# Altium schematic sheet VRM.SchDoc
size A4
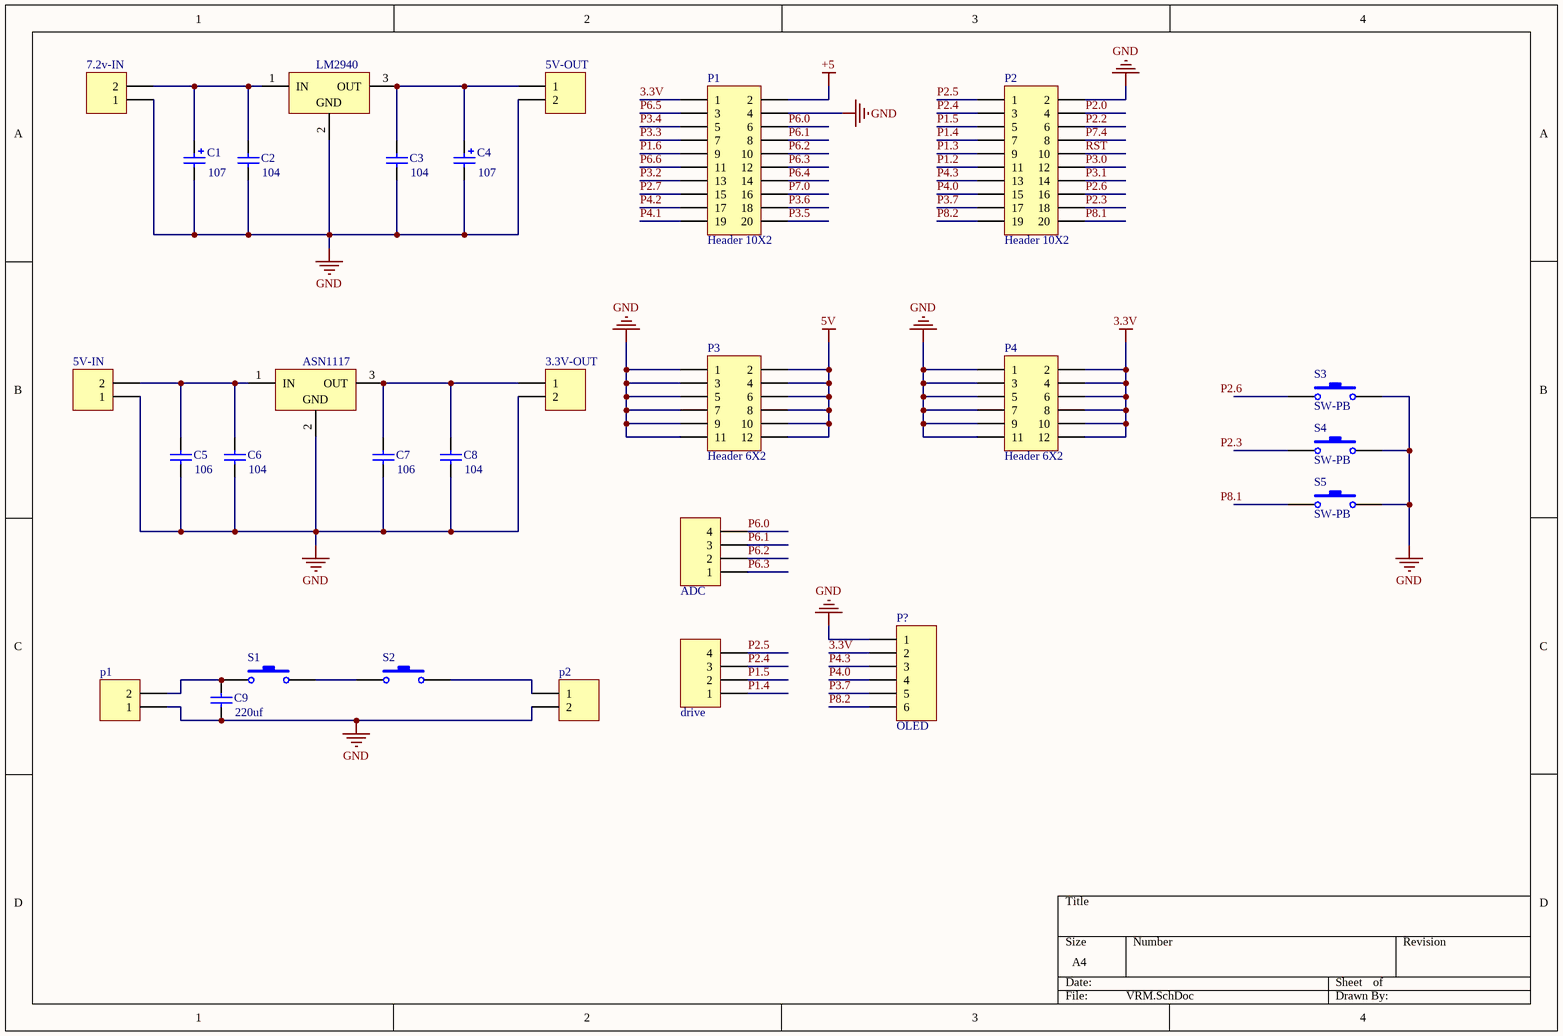
[diagram p0: VRM.SchDoc]

## Parts
(Parts that share a designator on the sheet are numbered #1, #2 ... from top to bottom, then left to right.)
3.3V-OUT  (no value)  [HDR1X2]
5V-IN  (no value)  [HDR1X2]
5V-OUT  (no value)  [HDR1X2]
7.2v-IN  (no value)  [HDR1X2]
?#1  LM2940  [T03B]
?#2  ASN1117  [T03B]
ADC  Header 4  [HDR4X1_A]  (value not drawn)
C1  value 107  [POLAR0.8]
C2  value 104  [RAD-0.3]
C3  value 104  [RAD-0.3]
C4  value 107  [POLAR0.8]
C5  value 106  [RAD-0.3]
C6  value 104  [RAD-0.3]
C7  value 106  [RAD-0.3]
C8  value 104  [RAD-0.3]
C9  value 220uf  [RAD-0.3]
drive  Header 4  [HDR4X1_A]  (value not drawn)
P1#1  Header 10X2  [HDR2X10]
p1#2  (no value)  [HDR1X2]
P2#1  Header 10X2  [HDR2X10]
p2#2  (no value)  [HDR1X2]
P3  Header 6X2  [HDR2X6]
P4  Header 6X2  [HDR2X6]
P?  OLED  [HDR6X1_B1]
S1  (no value)  [SW_PB2_A1]
S2  (no value)  [SW_PB2_A1]
S3  SW-PB  [SW_PB2_A1]
S4  SW-PB  [SW_PB2_A1]
S5  SW-PB  [SW_PB2_A1]

## Nets
3.3V: P1#1.1 P4.2 P4.4 P4.6 P4.8 P4.10 P4.12 P?.2
5V: P3.2 P3.4 P3.6 P3.8 P3.10 P3.12
+5: P1#1.2
GND: 3.3V-OUT.2 5V-IN.1 5V-OUT.2 7.2v-IN.1 ?#1.2(GND) ?#2.2(GND) C1.2 C2.1 C3.1 C4.2 C5.1 C6.1 C7.1 C8.1 C9.1 P1#1.4 p1#2.1 P2#1.2 p2#2.2 P3.1 P3.3 P3.5 P3.7 P3.9 P3.11 P4.1 P4.3 P4.5 P4.7 P4.9 P4.11 P?.1 S3.2 S4.2 S5.2
P1.2: P2#1.11
P1.3: P2#1.9
P1.4: drive.1 P2#1.7
P1.5: drive.2 P2#1.5
P1.6: P1#1.9
P2.0: P2#1.4
P2.2: P2#1.6
P2.3: P2#1.18
P2.4: drive.3 P2#1.3
P2.5: drive.4 P2#1.1
P2.6: P2#1.16
P2.7: P1#1.15
P3.0: P2#1.12
P3.1: P2#1.14
P3.2: P1#1.13
P3.3: P1#1.7
P3.4: P1#1.5
P3.5: P1#1.20
P3.6: P1#1.18
P3.7: P2#1.17 P?.5
P4.0: P2#1.15 P?.4
P4.1: P1#1.19
P4.2: P1#1.17
P4.3: P2#1.13 P?.3
P6.0: ADC.4 P1#1.6
P6.1: ADC.3 P1#1.8
P6.2: ADC.2 P1#1.10
P6.3: ADC.1 P1#1.12
P6.4: P1#1.14
P6.5: P1#1.3
P6.6: P1#1.11
P7.0: P1#1.16
P7.4: P2#1.8
P8.1: P2#1.20
P8.2: P2#1.19 P?.6
RST: P2#1.10
Net3.3V-OUT_1: 3.3V-OUT.1 ?#2.3(OUT) C7.2 C8.2
Net5V-IN_2: 5V-IN.2 ?#2.1(IN) C5.2 C6.2
Net5V-OUT_1: 5V-OUT.1 ?#1.3(OUT) C3.2 C4.1
Net7.2v-IN_2: 7.2v-IN.2 ?#1.1(IN) C1.1 C2.2
NetC9_2: C9.2 p1#2.2 S1.1
Netp2#2_1: p2#2.1 S2.2
NetS1_2: S1.2 S2.1

Not connected (* = marked no-connect by the designer): S3 1; S4 1; S5 1

## Notes on the sheet
- Labels drawn without touching a wire or pin: P2.3, P2.6, P8.1

## Library data of the parts
3.3V-OUT 5V-IN 5V-OUT 7.2v-IN p1#2 p2#2 = Header 2: Header, 2-Pin; LatestRevisionDate: 17-Jul-2002; LatestRevisionNote: Re-released for DXP Platform.; Publisher: Altium Limited
?#1 ?#2 = LM2940CT-5.0: 1A 5V; Note: Tab is connected to GND; Published: 15-Apr-2002; DatasheetVersion: Jun-1999; PackageVersion: 1995; PackageReference: T03B; Publisher: Altium Limited; PackageDescription: TO, Thru-Hole, Vertical, Heatsink Mounted; 3 In-Line Leads; Pitch 2.54 mm; ComponentLink1Description: Manufacturer Link; ComponentLink1URL: http://www.national.com/; ComponentLink2Description: Datasheet; ComponentLink2URL: http://www.national.com/ds.cgi/LM/LM2940.pdf; ComponentLink3Description: URL Link1; ComponentLink3URL: http://www.national.com/pf/LM/LM2940C.html
ADC drive = Header 4: 接插件; LatestRevisionDate: 17-Jul-2002; LatestRevisionNote: Re-released for DXP Platform.; Publisher: Altium Limited
C1 C4 = Cap Pol2: Polarized Capacitor (Axial); Published: 8-Jun-2000; LatestRevisionDate: 17-Jul-2002; LatestRevisionNote: Re-released for DXP Platform.; PackageReference: POLAR0.8; Publisher: Altium Limited; PackageDescription: Polarized Capacitor; 2 Leads
C2 C3 C5-C9 = Cap: Capacitor; Published: 8-Jun-2000; LatestRevisionDate: 17-Jul-2002; LatestRevisionNote: Re-released for DXP Platform.; PackageReference: RAD-0.3; Publisher: Altium Limited; PackageDescription: Radial Cap, Thru-Hole; 2 Leads; 0.3 in Pin Spacing
P1#1 P2#1 = Header 10X2: Header, 10-Pin, Dual row; LatestRevisionDate: 17-Jul-2002; LatestRevisionNote: Re-released for DXP Platform.; Publisher: Altium Limited
P3 P4 = Header 6X2: Header, 6-Pin, Dual row; LatestRevisionDate: 17-Jul-2002; LatestRevisionNote: Re-released for DXP Platform.; Publisher: Altium Limited
P? = Header 6: 接插件; LatestRevisionDate: 17-Jul-2002; LatestRevisionNote: Re-released for DXP Platform.; Publisher: Altium Limited
S1-S5 = SW-PB: 微动开关; Published: 24-Mar-1999; LatestRevisionDate: 17-Jul-2002; LatestRevisionNote: Re-released for DXP Platform.; PackageReference: SPST-2; Publisher: Altium Limited